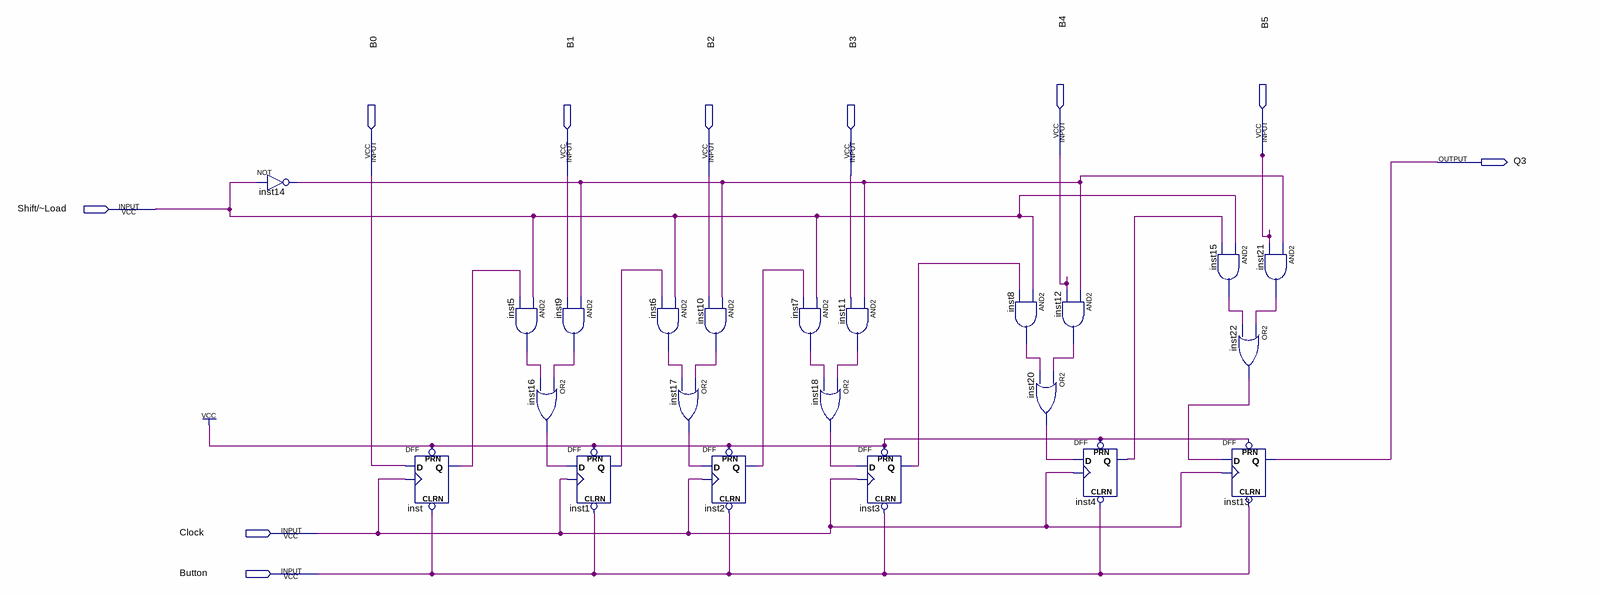
[diagram p0: schematic sheet]
// Quartus schematic shift_register_6bit.bdf as structural Verilog: 22 symbols, 10 pins
module shift_register_6bit (
  input  B4,
  input  B5,
  input  B0,
  input  B1,
  input  B2,
  input  B3,
  input  \Shift/~Load ,
  input  Clock,
  input  Button,
  output Q3
);

  wire inst1_q, inst2_q, inst3_q, inst4_q, inst5_out, inst6_out, inst7_out, inst8_out, inst9_out, inst10_out,
       inst11_out, inst12_out, inst14_out, inst15_out, inst16_out, inst17_out, inst18_out, inst20_out,
       inst21_out, inst22_out, inst_q;

  not inst14 (inst14_out, \Shift/~Load );
  DFF inst (.CLRN(Button), .CLK(Clock), .D(B0), .PRN(1'b1), .Q(inst_q));
  and inst5 (inst5_out, \Shift/~Load , inst_q);
  and inst9 (inst9_out, inst14_out, B1);
  or inst16 (inst16_out, inst9_out, inst5_out);
  DFF inst1 (.CLRN(Button), .CLK(Clock), .D(inst16_out), .PRN(1'b1), .Q(inst1_q));
  and inst6 (inst6_out, \Shift/~Load , inst1_q);
  or inst17 (inst17_out, inst10_out, inst6_out);
  and inst10 (inst10_out, inst14_out, B2);
  DFF inst2 (.CLRN(Button), .CLK(Clock), .D(inst17_out), .PRN(1'b1), .Q(inst2_q));
  and inst7 (inst7_out, \Shift/~Load , inst2_q);
  and inst11 (inst11_out, inst14_out, B3);
  or inst18 (inst18_out, inst11_out, inst7_out);
  DFF inst3 (.CLRN(Button), .CLK(Clock), .D(inst18_out), .PRN(1'b1), .Q(inst3_q));
  and inst8 (inst8_out, \Shift/~Load , inst3_q);
  and inst12 (inst12_out, inst14_out, B4);
  or inst20 (inst20_out, inst12_out, inst8_out);
  DFF inst4 (.CLRN(Button), .CLK(Clock), .D(inst20_out), .PRN(1'b1), .Q(inst4_q));
  and inst15 (inst15_out, \Shift/~Load , inst4_q);
  DFF inst13 (.CLRN(Button), .CLK(Clock), .D(inst22_out), .PRN(1'b1), .Q(Q3));
  and inst21 (inst21_out, inst14_out, B5);
  or inst22 (inst22_out, inst21_out, inst15_out);
endmodule
